# EAGLE schematic MIDI-daughter-board (EAGLE 9.0.0)
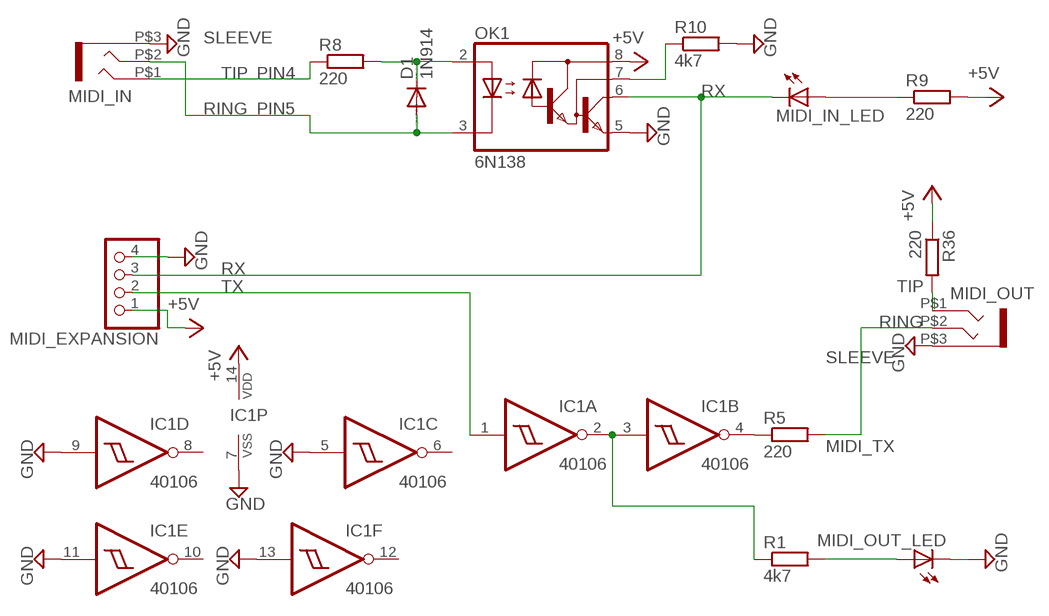
[diagram p0: schematic, sheet 1]

## Parts
D1  1N914  [D-6.35]
IC1  40106  40106N  [DIL14]
MIDI_EXPANSION  PINHD-1X4  [1X04]
MIDI_IN  WQP-PJ301M-STEREO  [WQP-PJ301M-STEREO]
MIDI_IN_LED  LED3MM-NB  [LED3MM]
MIDI_OUT  WQP-PJ301M-STEREO  [WQP-PJ301M-STEREO]
MIDI_OUT_LED  LED3MM-NB  [LED3MM]
OK1  6N138  [DIL08]
R1  4k7  BOX-RESISTOR  [0204/7]
R5  220  BOX-RESISTOR  [0204/7]
R8  220  BOX-RESISTOR  [0204/7]
R9  220  BOX-RESISTOR  [0204/7]
R10  4k7  BOX-RESISTOR  [0204/7]
R36  220  BOX-RESISTOR  [0204/7]

## Nets
+5V [power]: IC1.14(P:VDD) MIDI_EXPANSION.1 OK1.8(VCC) R9.2 R36.1
GND: IC1.5(C:I) IC1.7(P:VSS) IC1.9(D:I) IC1.11(E:I) IC1.13(F:I) MIDI_EXPANSION.4 MIDI_IN.P$3 MIDI_OUT.P$3 MIDI_OUT_LED.K(C) OK1.5(GND) R10.2
MIDI_TX: MIDI_OUT.P$2 R5.2
N$2: MIDI_OUT_LED.A R1.2
N$16: MIDI_IN_LED.A R9.1
N$43: IC1.2(A:O) IC1.3(B:I) R1.1
N$44: IC1.4(B:O) R5.1
N$45: MIDI_OUT.P$1 R36.2
N$52: OK1.7(VB) R10.1
N$53: D1.C OK1.2(A) R8.2
PIN4: MIDI_IN.P$1 R8.1
PIN5: D1.A MIDI_IN.P$2 OK1.3(C)
RX: MIDI_EXPANSION.3 MIDI_IN_LED.K(C) OK1.6(VO)
TX: IC1.1(A:I) MIDI_EXPANSION.2
Unconnected: IC1.6(C:O) IC1.8(D:O) IC1.10(E:O) IC1.12(F:O)

## Notes on the sheet
- SLEEVE
- TIP
- RING
- TIP
- RING
- SLEEVE

## Library data of the parts
D1 = toggle-nb:1N914
IC1 = 40xx:40106: Hex SCHMITT TRIGGER
MIDI_EXPANSION = pinhead:PINHD-1X4: PIN HEADER
MIDI_IN MIDI_OUT = thonkiconn:WQP-PJ301M-STEREO
MIDI_IN_LED MIDI_OUT_LED = toggle-nb:LED3MM-NB
OK1 = optocoupler:6N138: MOTOROLA OPTO COUPLER; MF: VISHAY/TELEFUNKEN; MPN: 6N138; OC_FARNELL: 9860150; OC_NEWARK: 35K5294
R1 R5 R8-R10 R36 = toggle-nb:BOX-RESISTOR

## Net classes
0 default: width 0.559 mm, clearance 0.152 mm
1 power: width 0.813 mm, clearance 0.152 mm